# Altium schematic sheet DAC_AK4493SEQ.SchDoc: =DocumentName
size 420 x 297 mm; CompanyName: "AS Manufacturing" LLC; Organization: "AS Manufacturing" LLC; Address1: 5 Sklyarenka St.; Address2: Kyiv 04073; Address3: Ukraine; Address4: https://ajax.systems/en/; DocumentNumber: 4; SheetNumber: 4; SheetTotal: 6; Template_version: 1.0.1
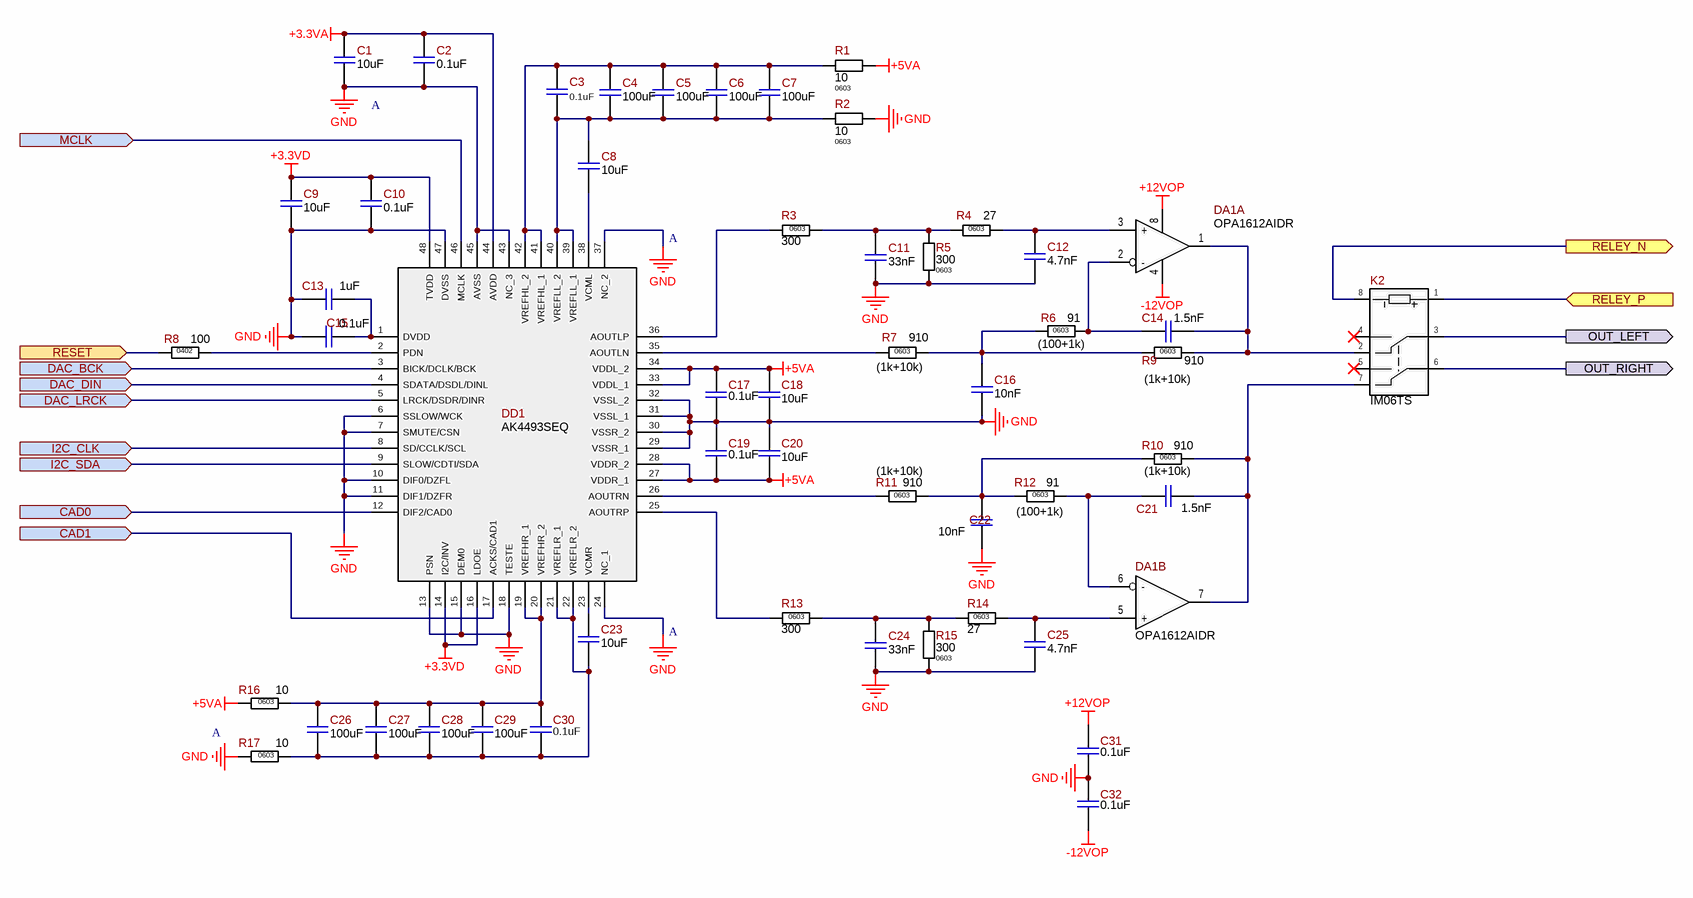
[diagram p0: DAC_AK4493SEQ.SchDoc]

## Parts
C1  10uF  [C0402(1005)]
C2  0.1uF  [C0402(1005)]
C3  0.1uF  [C0402(1005)]
C4  100uF  [C1206(3216)]
C5  100uF  [C1206(3216)]
C6  100uF  [C1206(3216)]
C7  100uF  [C1206(3216)]
C8  10uF  [C0402(1005)]
C9  10uF  [C0402(1005)]
C10  0.1uF  [C0402(1005)]
C11  33nF  [C0603(1608)]
C12  4.7nF  [C0603(1608)]
C13  1uF  [C0402(1005)]
C14  1.5nF  [C0603(1608)]
C15  0.1uF  [C0402(1005)]
C16  10nF  [C0603(1608)]
C17  0.1uF  [C0402(1005)]
C18  10uF  [C0402(1005)]
C19  0.1uF  [C0402(1005)]
C20  10uF  [C0402(1005)]
C21  1.5nF  [C0603(1608)]
C22  10nF  [C0603(1608)]
C23  10uF  [C0402(1005)]
C24  33nF  [C0603(1608)]
C25  4.7nF  [C0603(1608)]
C26  100uF  [C1206(3216)]
C27  100uF  [C1206(3216)]
C28  100uF  [C1206(3216)]
C29  100uF  [C1206(3216)]
C30  0.1uF  [C0402(1005)]
C31  0.1uF  [C0603(1608)]
C32  0.1uF  [C0603(1608)]
DA1  OPA1612AIDR  [SOIC8]  (parts A,B of 2)
DD1  AK4493SEQ  [LQFP48]
K2  IM06TS  [IM06]
R1  10  Package/Case: 0603  [R0603]
R2  10  Package/Case: 0603  [R0603]
R3  300  Package/Case: 0603  [R0603]
R4  27  Package/Case: 0603  [R0603]
R5  300  Package/Case: 0603  [R0603]
R6  91  Package/Case: 0603  [R0603]
R7  910  Package/Case: 0603  [R0603]
R8  100  Package/Case: 0402  [R0402]
R9  910  Package/Case: 0603  [R0603]
R10  910  Package/Case: 0603  [R0603]
R11  910  Package/Case: 0603  [R0603]
R12  91  Package/Case: 0603  [R0603]
R13  300  Package/Case: 0603  [R0603]
R14  27  Package/Case: 0603  [R0603]
R15  300  Package/Case: 0603  [R0603]
R16  10  Package/Case: 0603  [R0603]
R17  10  Package/Case: 0603  [R0603]

## Ports
CAD0 (in), CAD1 (in), DAC_BCK (in), DAC_DIN (in), DAC_LRCK (in), I2C_CLK (in), I2C_SDA (in), MCLK (in), OUT_LEFT (out), OUT_RIGHT (out), RELEY_N (out), RELEY_P (in), RESET (in)

## Nets
+3.3VA: C1.1 C2.1 DD1.44(AVDD)
+3.3VD: C9.1 C10.1 DD1.14(I2C/INV) DD1.16(LDOE) DD1.48(TVDD)
+5VA: C17.1 C18.1 C19.2 C20.2 DD1.27(VDDR_1) DD1.28(VDDR_2) DD1.33(VDDL_1) DD1.34(VDDL_2) R1.2 R16.2
+12VOP: C31.1 DA1.8(V+)
-12VOP: C32.2 DA1.4(V-)
GND: C1.2 C2.2 C9.2 C10.2 C11.1 C12.2 C13.2 C15.2 C16.2 C17.2 C18.2 C19.1 C20.1 C22.2 C24.1 C25.2 C31.2 C32.1 DD1.6(SSLOW/WCK) DD1.7(SMUTE/CSN) DD1.10(DIF0/DZFL) DD1.11(DIF1/DZFR) DD1.13(PSN) DD1.15(DEM0) DD1.18(TESTE) DD1.24(NC_1) DD1.29(VSSR_1) DD1.30(VSSR_2) DD1.31(VSSL_1) DD1.32(VSSL_2) DD1.37(NC_2) DD1.43(NC_3) DD1.45(AVSS) DD1.47(DVSS) R2.2 R5.2 R15.2 R17.2
CAD0: DD1.12(DIF2/CAD0) ; port CAD0
CAD1: DD1.17(ACKS/CAD1) ; port CAD1
DAC_BCK: DD1.3(BICK/DCLK/BCK) ; port DAC_BCK
DAC_DIN: DD1.4(SDATA/DSDL/DINL) ; port DAC_DIN
DAC_LRCK: DD1.5(LRCK/DSDR/DINR) ; port DAC_LRCK
I2C_CLK: DD1.8(SD/CCLK/SCL) ; port I2C_CLK
I2C_SDA: DD1.9(SLOW/CDTI/SDA) ; port I2C_SDA
MCLK: DD1.46(MCLK) ; port MCLK
OUT_LEFT: K2.3(1-COM) ; port OUT_LEFT
OUT_RIGHT: K2.6 ; port OUT_RIGHT
RELEY_N: K2.8(2-COM) ; port RELEY_N
RELEY_P: K2.1(Coil+) ; port RELEY_P
RESET: R8.1 ; port RESET
NetC3_1: C3.1 C4.2 C5.2 C6.2 C7.2 DD1.41(VREFHL_1) DD1.42(VREFHL_2) R1.1
NetC3_2: C3.2 C4.1 C5.1 C6.1 C7.1 C8.1 DD1.39(VREFLL_1) DD1.40(VREFLL_2) R2.1
NetC8_2: C8.2 DD1.38(VCML)
NetC11_2: C11.2 R3.1 R4.2 R5.1
NetC12_1: C12.1 DA1.3(+) R4.1
NetC13_1: C13.1 C15.1 DD1.1(DVDD)
NetC14_1: C14.1 DA1.1(Out) K2.2(1-CLOSED) R9.1
NetC14_2: C14.2 DA1.2(-) R6.2
NetC16_1: C16.1 R6.1 R7.1 R9.2
NetC21_1: C21.1 DA1.7(Out) K2.7(2-OPEN) R10.1
NetC21_2: C21.2 DA1.6(-) R12.1
NetC22_1: C22.1 R10.2 R11.1 R12.2
NetC23_1: C23.1 DD1.23(VCMR)
NetC23_2: C23.2 C26.2 C27.2 C28.2 C29.2 C30.2 DD1.21(VREFLR_1) DD1.22(VREFLR_2) R17.1
NetC24_2: C24.2 R13.1 R14.2 R15.1
NetC25_1: C25.1 DA1.5(+) R14.1
NetC26_1: C26.1 C27.1 C28.1 C29.1 C30.1 DD1.19(VREFHR_1) DD1.20(VREFHR_2) R16.1
NetDD1_2: DD1.2(PDN) R8.2
NetDD1_25: DD1.25(AOUTRP) R13.2
NetDD1_26: DD1.26(AOUTRN) R11.2
NetDD1_35: DD1.35(AOUTLN) R7.2
NetDD1_36: DD1.36(AOUTLP) R3.2

Not connected (* = marked no-connect by the designer): K2 4(1-OPEN)* 5*

## Notes on the sheet
- A
- (near DD1) A
- (near R7) (1k+10k)
- (near R6) (100+1k)
- (near R9) (1k+10k)
- (near R11) (1k+10k)
- (near R12) (100+1k)
- (near R10) (1k+10k)
- 1
- 2
- 3
- 4
- 5
- 6
- 7
- 8
- B
- C
- D
- E
- F
- Назва проекту
- Мова
- UA
- Розробник
- Формат
- A3
- Версія
- Дата
- Лист
- /

## Library data of the parts
C1 C8 C9 C18 C20 C23 = 10uF  6.3V C0402: CAP CER 10UF 6.3V X6S 0402; Manufacturer: Murata Electronics North America; Manufacturer P/N: GRM155C80J106ME11D; Name Component: Capacitor Ceramic; Tolerance: ±20%; Operation Temperature: -55°C ~ 105°C; Library Path 1: Capacitors.SchLib; Part Number: 10uF  6.3V C0402; Value: 10uF; Temperature Coefficient: X6S; Power (V/A): 6.3V; Package/Case: C0402; Supplier 1: Digi-key; Supplier Part Number 1: 490-13233-2-ND; ComponentLink1Description: Datasheet; ComponentLink1URL: https://www.murata.com/~/media/webrenewal/support/library/catalog/products/capacitor/mlcc/c02e.ashx?la=en-us
C2 C3 C10 C15 C17 C19 = 0.1uF  25V C0403: CAP CER 0.1UF 25V X7R 0603; Manufacturer: Samsung Electro-Mechanics; Name Component: Capacitor Ceramic; Tolerance: ±10%; Operation Temperature: -55°C ~ 125°C; Library Path 1: Capacitors.SchLib; Part Number: 0.1uF  25V C0403; Value: 0.1uF; Temperature Coefficient: X7R; Power (V/A): 25V; Package/Case: C0403; Supplier Part Number 1: 1276-6854-2-ND; ComponentLink1Description: Datasheet
C4-C7 C26-C29 = 100uF  10V С1206: CAP CER 100UF 10V X5T 1206; Name Component: Capacitor Ceramic; Tolerance: ±20%; Operation Temperature: -55°C ~ 105°C; Temperature Coefficient: X5R; Library Path 1: Capacitors.SchLib; Part Number: 100uF  10V С1206; Value: 100uF; Power (V/A): 10V; Package/Case: С1206; Supplier 1: Digi-key; ComponentLink1Description: Datasheet
C11 C24 = 33nF  25V C0603: CAP CER 0.033UF 25V X7R 0603; Manufacturer: AVX Corporation; Manufacturer P/N: 06033C333M4T2A; Name Component: Capacitor Ceramic; Tolerance: ±20%; Operation Temperature: -55°C ~ 105°C; Library Path 1: Capacitors.SchLib; Part Number: 33nF  25V C0603; Value: 33nF; Temperature Coefficient: X7R; Power (V/A): 25V; Package/Case: C0603; Supplier 1: Digi-key; Supplier Part Number 1: 06033C333M4T2A-ND; ComponentLink1Description: Datasheet; ComponentLink1URL: http://catalogs.avx.com/SurfaceMount.pdf
C12 C25 = 4.7nF  16V C0603: CAP CER 4.7nF 16V X7R 0603; Manufacturer: AVX Corporation; Manufacturer P/N: 0603YC472KAT2A; Name Component: Capacitor Ceramic; Tolerance: ±10%; Operation Temperature: -55°C ~ 105°C; Library Path 1: Capacitors.SchLib; Part Number: 4.7nF  16V C0603; Value: 4.7nF; Temperature Coefficient: X7R; Power (V/A): 16V; Package/Case: C0603; Supplier 1: Digi-key; Supplier Part Number 1: 0603YC472KAT2A-ND; ComponentLink1Description: Datasheet; ComponentLink1URL: http://catalogs.avx.com/SurfaceMount.pdf
C13 = 1uF  10V C0402: CAP CER 1UF 10V X7S 0402; Manufacturer: Murata Electronics North America; Manufacturer P/N: GRM155C71A105KE11D; Name Component: Capacitor Ceramic; Tolerance: ±10%; Operation Temperature: -55°C ~ 105°C; Library Path 1: Capacitors.SchLib; Part Number: 1uF  10V C0402; Value: 1uF; Temperature Coefficient: X7S; Power (V/A): 10V; Package/Case: C0402; Supplier 1: Digi-key; Supplier Part Number 1: 490-14457-2-ND; ComponentLink1Description: Datasheet; ComponentLink1URL: https://www.murata.com/~/media/webrenewal/support/library/catalog/products/capacitor/mlcc/c02e.ashx?la=en-us
C14 C21 = 1.5nF  25V C0603: CAP CER 1.5nF 25V X7R 0603; Manufacturer: AVX Corporation; Manufacturer P/N: 06033C152KAT2A; Name Component: Capacitor Ceramic; Tolerance: ±10%; Operation Temperature: -55°C ~ 105°C; Library Path 1: Capacitors.SchLib; Part Number: 1.5nF  25V C0603; Value: 1.5nF; Temperature Coefficient: X7R; Power (V/A): 25V; Package/Case: C0603; Supplier 1: Digi-key; Supplier Part Number 1: 06033C152KAT2A-ND; ComponentLink1Description: Datasheet; ComponentLink1URL: http://catalogs.avx.com/SurfaceMount.pdf
C16 C22 = 10nF  10V C0603: CAP CER 10nF 10V X5R 0603; Manufacturer: AVX Corporation; Manufacturer P/N: 0603ZD103KAT2A; Name Component: Capacitor Ceramic; Tolerance: ±10%; Operation Temperature: -55°C ~ 105°C; Library Path 1: Capacitors.SchLib; Part Number: 10nF  10V C0603; Value: 10nF; Temperature Coefficient: X5R; Power (V/A): 10V; Package/Case: C0603; Supplier 1: Digi-key; Supplier Part Number 1: 0603ZD103KAT2A-ND; ComponentLink1Description: Datasheet; ComponentLink1URL: http://catalogs.avx.com/SurfaceMount.pdf
C30 = 0.1uF  25V C0403: CAP CER 0.1UF 25V X7R 0402; Manufacturer: Samsung Electro-Mechanics; Name Component: Capacitor Ceramic; Tolerance: ±10%; Operation Temperature: -55°C ~ 125°C; Library Path 1: Capacitors.SchLib; Part Number: 0.1uF  25V C0403; Value: 0.1uF; Temperature Coefficient: X7R; Power (V/A): 25V; Package/Case: C0403; Supplier Part Number 1: 1276-6854-2-ND; ComponentLink1Description: Datasheet
C31 C32 = 0.1uF  50V C0603: CAP CER 0.1UF 50V X7R 0603; Manufacturer: Samsung Electro-Mechanics; Manufacturer P/N: CL10B104KB8WPNC; Name Component: Capacitor Ceramic; Tolerance: ±10%; Operation Temperature: -55°C ~ 125°C; Library Path 1: Capacitors.SchLib; Notes: 06035C104K4T4A, 06035C104K4T2A; Part Number: 0.1uF  50V C0603; Value: 0.1uF; Temperature Coefficient: X7R; Power (V/A): 50V; Package/Case: C0603; Supplier Part Number 1: 1276-6854-2-ND; ComponentLink1Description: Datasheet; Supplier 1: Digi-key; ComponentLink1URL: https://www.samsungsem.com/resources/file/global/support/product_catalog/MLCC.pdf
DA1 = OPA1612AIDR: Audio Amplifier 2 Circuit Rail-to-Rail 8-SOIC; Manufacturer: Texas Instruments; Name Component: Operational amplifier; Operation Temperature: -40°C ~ 85°C; Power (V/A): 4.5V-36; Library Path 1: Integrated Circuit.SchLib; ComponentLink1URL: https://www.ti.com/general/docs/suppproductinfo.tsp?distId=10&gotoUrl=https%3A%2F%2Fwww.ti.com%2Flit%2Fgpn%2Fopa1611; ComponentLink1Description: Datasheet; Part Number: OPA1612AIDR; Value: OPA1612AIDR; Package/Case: 8-SOIC; Manufacturer P/N: OPA1612AIDR; Supplier 1: Digi-key; Supplier Part Number 1: 296-39098-6-ND
DD1 = AK4493SEQ: IC DAC/AUDIO 32BIT 768K 48LQFP (7x7); Manufacturer: Asahi Kasei Microdevices/AKM; Name Component: Audio DAC; Operation Temperature: -40°C ~ 85°C; Power (V/A): ---; Library Path 1: Integrated Circuit.SchLib; Part Number: AK4493SEQ; Value: AK4493SEQ; Package/Case: 48-LQFP; Manufacturer P/N: AK4493SEQ; Supplier 1: Digi-key; Supplier Part Number 1: 974-AK4493SEQDKR-ND; ComponentLink1Description: Datasheet; ComponentLink1URL: https://www.akm.com/global/en/products/audio/audio-dac/ak4493seq/
K2 = IM06TS: RELAY TELECOM DPDT 2A 12V coil current 11.6 mA; Manufacturer_Name: Hongfa; Manufacturer_Part_Number: HFD31/5; Power (V/A): 12V 11.6 mA; Library Path 1: Others.SchLib; Datasheet Link: https://source.hongfa.com//Api/DownloadPdf/152; Height: 5.4mm; Arrow Part Number: HFD31/5; Arrow Price/Stock: https://www.arrow.com/en/products/hfd315/hongfa-europe-gmbh?region=europe; Part Number: IM06TS; Name Component: Relay; Value: IM06TS; Supplier 1: Kosmodrom; ComponentLink1Description: Datasheet; ComponentLink1URL: https://www.te.com/usa-en/product-2-1462037-7.datasheet.pdf
R1 R2 R16 R17 = 10  R0603: RES SMD 10 OHM  ±1% 1/10W 0603; Power Rating: 0.1W; Name Component: Resistror; Operation Temperature: -55℃ to 155℃; Temperature Coefficient: ±200 ppm/°C; Library Path 1: Resistor.SchLib; Part Number: 10  R0603; Value: 10; Tolerance: ±1%
R3 R5 R13 R15 = 300  R0603: RES SMD 300 OHM  ±1% 1/10W 0603; Power Rating: 0.1W; Name Component: Resistror; Operation Temperature: -55℃ to 155℃; Temperature Coefficient: ±100 ppm/°C; Library Path 1: Resistor.SchLib; Part Number: 300  R0603; Value: 300; Tolerance: ±1%
R4 R14 = 27  R0603: RES SMD 27 OHM  ±1% 1/10W 0603; Power Rating: 0.1W; Name Component: Resistror; Operation Temperature: -55℃ to 155℃; Temperature Coefficient: ±100 ppm/°C; Library Path 1: Resistor.SchLib; Part Number: 27  R0603; Value: 27; Tolerance: ±1%
R6 R12 = 91  R0603: RES SMD 91 OHM  ±1% 1/10W 0603; Power Rating: 0.1W; Name Component: Resistror; Operation Temperature: -55℃ to 155℃; Temperature Coefficient: ±100 ppm/°C; Library Path 1: Resistor.SchLib; Part Number: 91  R0603; Value: 91; Tolerance: ±1%
R7 R9-R11 = 910  R0603: RES SMD 910 OHM  ±1% 1/10W 0603; Power Rating: 0.1W; Name Component: Resistror; Operation Temperature: -55℃ to 155℃; Temperature Coefficient: ±100 ppm/°C; Library Path 1: Resistor.SchLib; Part Number: 910  R0603; Value: 910; Tolerance: ±1%
R8 = 100  R0402: RES SMD 100 OHM  ±1% 1/16W 0402; Power Rating: 0.063W; Name Component: Resistror; Operation Temperature: -55℃ to 155℃; Temperature Coefficient: ±100 ppm/°C; Library Path 1: Resistor.SchLib; Part Number: 100  R0402; Value: 100; Tolerance: ±1%